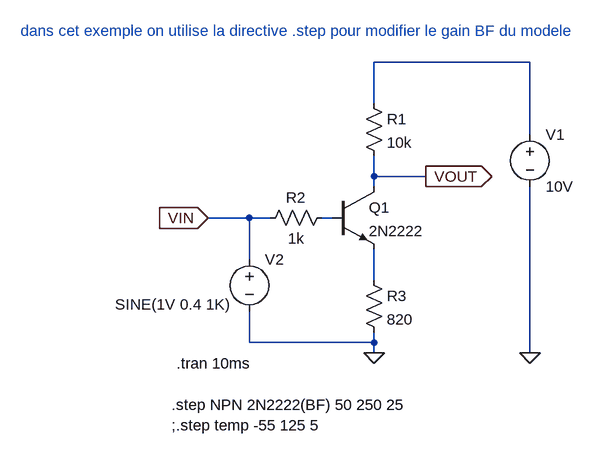
[diagram p0: schematic npn_essai2.asc]
npn_essai2.asc, the LTspice schematic file:
Version 4
SHEET 1 880 680
WIRE 336 48 96 48
WIRE 96 112 96 48
WIRE 336 160 336 48
WIRE 96 224 96 192
WIRE 176 224 96 224
WIRE 96 240 96 224
WIRE -96 288 -160 288
WIRE -64 288 -96 288
WIRE 32 288 16 288
WIRE -96 352 -96 288
WIRE 96 384 96 336
WIRE -96 480 -96 432
WIRE 96 480 96 464
WIRE 96 480 -96 480
WIRE 96 496 96 480
WIRE 336 496 336 240
FLAG 96 496 0
FLAG 336 496 0
FLAG 176 224 VOUT
IOPIN 176 224 Out
FLAG -160 288 VIN
IOPIN -160 288 In
SYMBOL npn 32 240 R0
SYMATTR InstName Q1
SYMATTR Value 2N2222
SYMBOL res 80 96 R0
SYMATTR InstName R1
SYMATTR Value 10k
SYMBOL voltage 336 144 R0
WINDOW 123 0 0 Left 0
WINDOW 39 0 0 Left 0
SYMATTR InstName V1
SYMATTR Value 10V
SYMBOL voltage -96 336 R0
WINDOW 3 -207 85 Left 0
WINDOW 123 0 0 Left 0
WINDOW 39 0 0 Left 0
SYMATTR Value SINE(1V 0.4 1K)
SYMATTR InstName V2
SYMBOL res 32 272 R90
WINDOW 0 0 56 VBottom 0
WINDOW 3 32 56 VTop 0
SYMATTR InstName R2
SYMATTR Value 1k
SYMBOL res 80 368 R0
SYMATTR InstName R3
SYMATTR Value 820
TEXT -208 512 Left 0 !.tran 10ms
TEXT -216 576 Left 0 !.step NPN 2N2222(BF) 50 250 25\n;.step temp -55 125 5
TEXT -448 0 Left 0 ;dans cet exemple on utilise la directive .step pour modifier le gain BF du modele

The netlist it stands for:
* npn_essai2.asc
Q1 VOUT N002 N003 0 2N2222
R1 N001 VOUT 10k
V1 N001 0 10V
V2 VIN 0 SINE(1V 0.4 1K)
R2 N002 VIN 1k
R3 N003 0 820
.model NPN NPN
.model PNP PNP
.lib standard.bjt
.tran 10ms
.step NPN 2N2222(BF) 50 250 25
;.step temp -55 125 5
* dans cet exemple on utilise la directive .step pour modifier le gain BF du modele
.backanno
.end